# Altium schematic sheet SCH4_RGB_Indicator.SchDoc: Airsoft FAN Controller
size A4
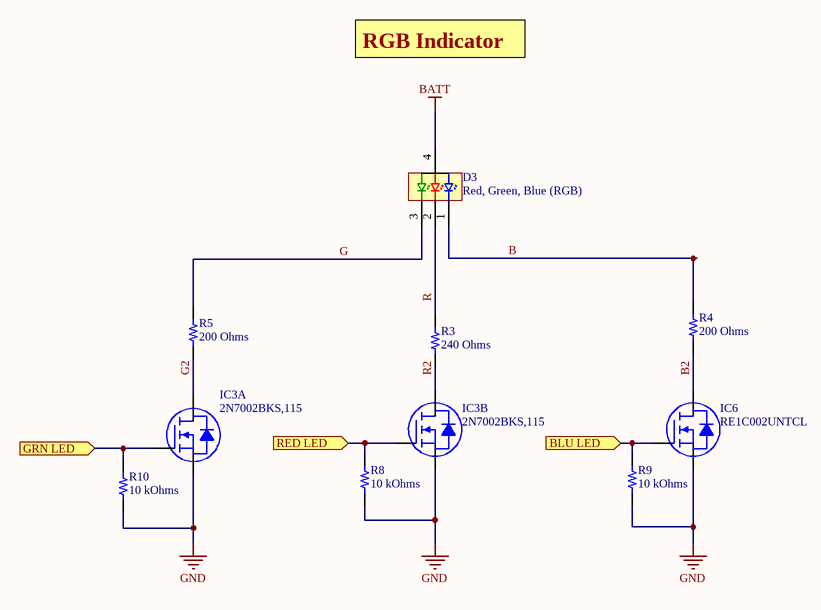
[diagram p0: SCH4_RGB_Indicator.SchDoc]

## Parts
D3  Red, Green, Blue (RGB)  [Citizen CL-505S-X-SD-T]
IC3  2N7002BKS,115  [NXP SOT-363]  (parts A,B of 2)
IC6  RE1C002UNTCL  [ROHM SC-89-SOT-490]
R3  240 Ohms  [RES 0402_1005]
R4  200 Ohms  [RES 0402_1005]
R5  200 Ohms  [RES 0402_1005]
R8  10 kOhms  [RES 0402_1005]
R9  10 kOhms  [RES 0402_1005]
R10  10 kOhms  [RES 0402_1005]

## Ports
BLU LED (in), GRN LED (in), RED LED (in)

## Nets
BATT: D3.4(A3)
GND: IC3.1(S1) IC3.4(S2) IC6.2(S) R8.1 R9.1 R10.1
B: D3.1(C1) R4.2
B2: IC6.3(D) R4.1
BLU LED: IC6.1(G) R9.2 ; port BLU LED
G: D3.3(C3) R5.2
G2: IC3.6(D1) R5.1
GRN LED: IC3.2(G1) R10.2 ; port GRN LED
R: D3.2(C2) R3.2
R2: IC3.3(D2) R3.1
RED LED: IC3.5(G2) R8.2 ; port RED LED

## Notes on the sheet
- RGB Indicator
- Title
- Size:
- Date:
- A4
- Number:
- Time:
- Revision:
- Sheet
- of
- File:

## Library data of the parts
D3 = CL-505S-X-SD-T: LED TRI TOP FIRING 1.0 X 1.0; Manufacturer: Citizen; Configuration: Common Anode; Current - Test: 5mA Red, 5mA Green, 5mA Blue; Lens Color: 0.26mm; Lens Size: 1.00mm; Lens Style: Square with Flat Top; Millicandela Rating: 40mcd Red, 220mcd Green, 65mcd Blue; Voltage - Forward (Vf) (Typ): 1.85V Red, 2.7V Green, 2.75V Blue; Wavelength - Dominant: 615nm Red, 530nm Green, 470nm Blue; Part Number: CL-505S-X-SD-T; Color: Red, Green, Blue (RGB); ComponentLink1Description: Datasheet; ComponentLink1URL: http://ce.citizen.co.jp/up_img/product/sQNrj4RlM7o2/CL-505S_e.pdf; ComponentLink2Description: DigiKey Link; ComponentLink2URL: http://digikey.com/product-detail/en/citizen/CL-505S-X-SD-T/1642-1510-1-ND/6005950; Device Package: 0404 (1010 Metric); Height (Max): 0.26mm; LastUpdated: 3/19/2020 10:25:23 PM; Lifecycle Status: Active; Minimum Order: 1; Mounting Type: Surface Mount; Package / Case: 0404 (1010 Metric); Packaging: TapeAndReel; PartId: 955; Part Status: Active; Price: 0.23; Series: CL-505S; Size / Dimension: 1.00mm L x 1.00mm W; Supplier 1: DigiKey; Supplier Part Number 1: 1642-1510-1-ND; Value: Red, Green, Blue (RGB)
IC3 = 2N7002BKS,115: MOSFET 2N-CH 60V 0.3A 6TSSOP; Manufacturer: Nexperia USA Inc.; Current - Continuous Drain (Id) @ 25°C: 300mA; FET Feature: Logic Level Gate; FET Type: 2 N-Channel (Dual); Gate Charge (Qg) (Max) @ Vgs: 0.6nC @ 4.5V; Input Capacitance (Ciss) (Max) @ Vds: 50pF @ 10V; Power - Max: 295mW; Rds On (Max) @ Id, Vgs: 1.6Ohm @ 500mA, 10V; Vgs(th) (Max) @ Id: 2.1V @ 250µA; Part Number: 2N7002BKS,115; ComponentLink1Description: Datasheet; ComponentLink1URL: https://assets.nexperia.com/documents/data-sheet/2N7002BKS.pdf; ComponentLink2Description: DigiKey Link; ComponentLink2URL: http://digikey.com/product-detail/en/nexperia-usa-inc/2N7002BKS115/1727-4786-1-ND/2531264; Drain to Source Voltage (Vdss): 60V; LastUpdated: 9/2/2020 1:29:59 AM; Lifecycle Status: Active; Minimum Order: 1; Mounting Type: Surface Mount; Operating Temperature: 150°C (TJ); Package / Case: 6-TSSOP, SC-88, SOT-363; Packaging: TapeAndReel; Part Status: Active; Price: 0.08; Series: Automotive, AEC-Q101, TrenchMOS™; Supplier 1: DigiKey; Supplier Part Number 1: 1727-4786-1-ND; Supplier Device Package: 6-TSSOP
IC6 = RE1C002UNTCL: MOSFET N-CH 20V 0.2A EMT3; Manufacturer: Rohm Semiconductor; Current - Continuous Drain (Id) @ 25°C: 200mA (Ta); Drive Voltage (Max Rds On,  Min Rds On): 1.2V, 2.5V; FET Type: N-Channel; Input Capacitance (Ciss) (Max) @ Vds: 25pF @ 10V; Power Dissipation (Max): 150mW (Ta); Rds On (Max) @ Id, Vgs: 1.2Ohm @ 100mA, 2.5V; Vgs (Max): ±8V; Vgs(th) (Max) @ Id: 1V @ 1mA; Part Number: RE1C002UNTCL; ComponentLink1Description: Datasheet; ComponentLink1URL: https://www.rohm.com/datasheet/RE1C002UN/re1c002untcl-e; ComponentLink2Description: DigiKey Link; ComponentLink2URL: http://digikey.com/product-detail/en/rohm-semiconductor/RE1C002UNTCL/RE1C002UNTCLCT-ND/5042535; Drain to Source Voltage (Vdss): 20V; LastUpdated: 9/2/2020 1:30:13 AM; Lifecycle Status: Active; Minimum Order: 1; Mounting Type: Surface Mount; Operating Temperature: 150°C (TJ); Package / Case: SC-89, SOT-490; Packaging: TapeAndReel; Part Status: Active; Price: 0.03; Series: -; Supplier 1: DigiKey; Supplier Part Number 1: RE1C002UNTCLCT-ND; Supplier Device Package: EMT3F (SOT-416FL); Technology: MOSFET (Metal Oxide)
R3 = RR0510P-241-D: RES SMD 240 OHM 0.5% 1/16W 0402; Manufacturer: Susumu; Power (Watts): 0.063W, 1/16W; Temperature Coefficient: ±25ppm/°C; Part Number: RR0510P-241-D; Value: 240 Ohms; ComponentLink1Description: Datasheet; ComponentLink1URL: http://www.susumu.co.jp/common/pdf/n_catalog_partition05_en.pdf; ComponentLink2Description: DigiKey Link; ComponentLink2URL: http://digikey.com/product-detail/en/susumu/RR0510P-241-D/RR05P240DCT-ND/432922; Composition: Thin Film; Device Package: 0402 (1005 Metric); Height - Seated (Max): 0.016" (0.40mm); LastUpdated: 9/2/2020 1:08:09 AM; Lifecycle Status: Active; Minimum Order: 1; Number of Terminations: 2; Operating Temperature: -55°C ~ 125°C; Package / Case: 0402 (1005 Metric); Packaging: TapeAndReel; PartId: 3287; Part Status: Active; Price: 0.01; Resistance: 240 Ohms; Series: RR; Size / Dimension: 0.039" L x 0.020" W (1.00mm x 0.50mm); Supplier 1: DigiKey; Supplier Part Number 1: RR05P240DCT-ND; Tolerance: ±0.5%
R4 R5 = RR0510P-201-D: RES SMD 200 OHM 0.5% 1/16W 0402; Manufacturer: Susumu; Power (Watts): 0.063W, 1/16W; Temperature Coefficient: ±25ppm/°C; Part Number: RR0510P-201-D; Value: 200 Ohms; ComponentLink1Description: Datasheet; ComponentLink1URL: http://www.susumu.co.jp/common/pdf/n_catalog_partition05_en.pdf; ComponentLink2Description: DigiKey Link; ComponentLink2URL: http://digikey.com/product-detail/en/susumu/RR0510P-201-D/RR05P200DCT-ND/432920; Composition: Thin Film; Device Package: 0402 (1005 Metric); Height - Seated (Max): 0.016" (0.40mm); LastUpdated: 9/2/2020 1:08:09 AM; Lifecycle Status: Active; Minimum Order: 1; Number of Terminations: 2; Operating Temperature: -55°C ~ 125°C; Package / Case: 0402 (1005 Metric); Packaging: TapeAndReel; PartId: 3269; Part Status: Active; Price: 0.01; Resistance: 200 Ohms; Series: RR; Size / Dimension: 0.039" L x 0.020" W (1.00mm x 0.50mm); Supplier 1: DigiKey; Supplier Part Number 1: RR05P200DCT-ND; Tolerance: ±0.5%
R8-R10 = ASC0402-10KF1: RES 10 KOHM 1% 1/16W 0402; Manufacturer: Riedon; Power (Watts): 0.063W, 1/16W; Temperature Coefficient: ±100ppm/°C; Part Number: ASC0402-10KF1; Value: 10 kOhms; ComponentLink1Description: Datasheet; ComponentLink1URL: https://riedon.com/media/pdf/ASC.pdf; ComponentLink2Description: DigiKey Link; ComponentLink2URL: http://digikey.com/product-detail/en/riedon/ASC0402-10KF1/696-1775-1-ND/7398745; Composition: Thick Film; Device Package: 0402 (1005 Metric); Features: Anti-Sulfur, Automotive AEC-Q200, Moisture Resistant; Height - Seated (Max): 0.016" (0.40mm); LastUpdated: 9/2/2020 1:07:48 AM; Lifecycle Status: Active; Minimum Order: 1; Number of Terminations: 2; Operating Temperature: -55°C ~ 155°C; Package / Case: 0402 (1005 Metric); Packaging: TapeAndReel; PartId: 12809; Part Status: Active; Price: 0.01; Ratings: AEC-Q200; Resistance: 10 kOhms; Series: ASC; Size / Dimension: 0.039" L x 0.020" W (1.00mm x 0.50mm); Supplier 1: DigiKey; Supplier Part Number 1: 696-1775-1-ND; Supplier Device Package: 0402; Tolerance: ±1%